# Altium schematic sheet i2c_to_gpio.SchDoc
size A4; SheetNumber: 6; SheetTotal: 6
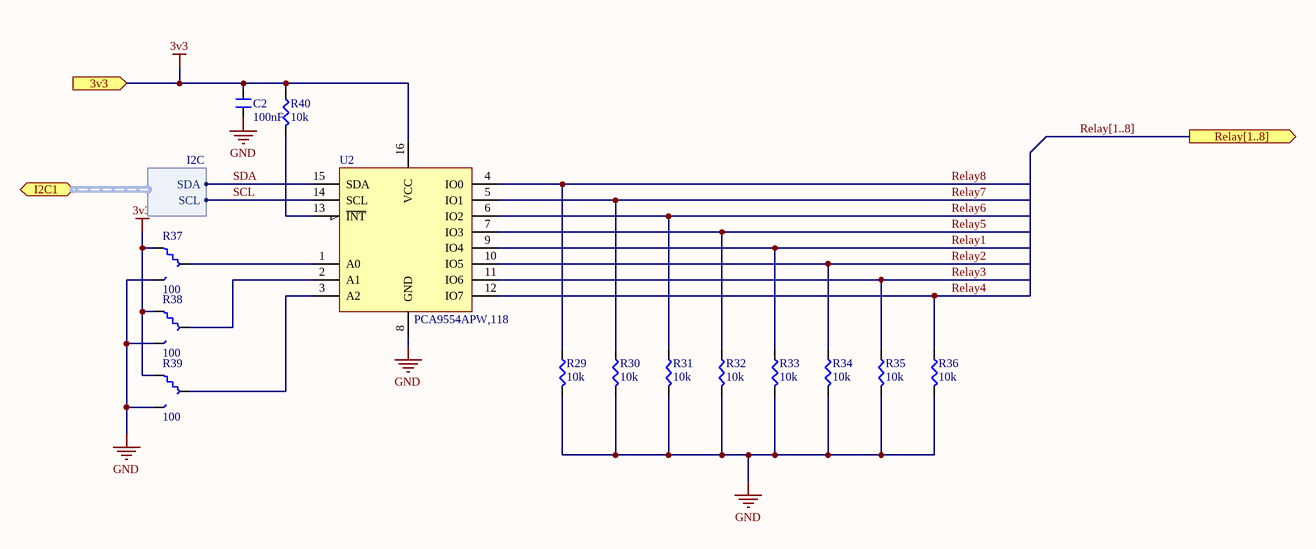
[diagram p0: i2c_to_gpio.SchDoc]

## Parts
C2  100nF  [CAP0603]
R29  10k  [RES0603]
R30  10k  [RES0603]
R31  10k  [RES0603]
R32  10k  [RES0603]
R33  10k  [RES0603]
R34  10k  [RES0603]
R35  10k  [RES0603]
R36  10k  [RES0603]
R37  100  [RES0603_CHANGE]
R38  100  [RES0603_CHANGE]
R39  100  [RES0603_CHANGE]
R40  10k  [RES0603]
U2  PCA9554APW,118  [TSSOP16]

## Ports
3v3 (in), I2C1 (bidir, harness I2C), Relay[1..8] (out)

## Harnesses
I2C: SDA, SCL

## Nets
3v3: C2.2 R37.1 R38.1 R39.1 R40.1 U2.16(VCC) ; port 3v3
GND: C2.1 R29.2 R30.2 R31.2 R32.2 R33.2 R34.2 R35.2 R36.2 R37.3 R38.3 R39.3 U2.8(GND)
Relay1: R33.1 U2.9(IO4)
Relay2: R34.1 U2.10(IO5)
Relay3: R35.1 U2.11(IO6)
Relay4: R36.1 U2.12(IO7)
Relay5: R32.1 U2.7(IO3)
Relay6: R31.1 U2.6(IO2)
Relay7: R30.1 U2.5(IO1)
Relay8: R29.1 U2.4(IO0)
SCL: U2.14(SCL) ; port I2C1.SCL
SDA: U2.15(SDA) ; port I2C1.SDA
NetR37_2: R37.2 U2.1(A0)
NetR38_2: R38.2 U2.2(A1)
NetR39_2: R39.2 U2.3(A2)
NetR40_2: R40.2 U2.13(~{INT})

## Buses and harness runs
bus Relay[1..8] = port Relay[1..8]

## Library data of the parts
C2 = GCM188R71H104KA57J: Tolerance ±10% / Rated Voltage 50Vdc / Temperature 0±30ppm/℃; Manufacturer: Arrow Electronics; Item: 100nF 50V  ±10%; Vdc: 50V; Part Number: GCM188R71H104KA57J; Supplier 1: Mouser; Supplier Part Number 1: 81-GCM188R71H104KA7J; Case: 0603; Tolerance: 10%; Value: 100nF; HelpURL: http://www.farnell.com/datasheets/4360.pdf?src-supplier=Element14; Category: Multilayer Ceramic Capacitors - SMD/SMT
R29-R36 R40 = CR0603-FX-1002ELF: Tolerance ±1% / Power (Watts) 0.1W, 1/10W / Temperature Coefficient ±100ppm/°C; Manufacturer: Bourns; Item: 10k  ±1% 0.1W; Part Number: CR0603-FX-1002ELF; Supplier 1: Mouser; Supplier Part Number 1: 652-CR0603FX-1002ELF; Case: 0603; Tolerance: 1%; Value: 10k; HelpURL: https://eu.mouser.com/datasheet/2/54/cr-1858361.pdf; Category: Thin Film Resistors - SMD
R37-R39 = ERJ-3EKF9101V (Jump_RES): Tolerance ±1% / Power (Watts) 0.1W, 1/10W / Temperature Coefficient ±100ppm/°C; Manufacturer: Panasonic; Item: 100 ±1% 0.1W (Jump_RES); Part Number: ERJ-3EKF9101V (Jump_RES); Supplier 1: Mouser; Supplier Part Number 1: 667-ERJ-3EKF9101V; Case: 0603; Tolerance: 1%; Value: 100; HelpURL: https://eu.mouser.com/datasheet/2/315/AOA0000C304-1149620.pdf; Category: Thin Film Resistors - SMD
U2 = PCA9554APW,118: Interface - I/O Expander I2C I/O; Manufacturer: NXP; Part Number: PCA9554APW,118; Item: PCA9554APW,118; Supplier 1: Mouser; Supplier Part Number 1: 771-PCA9554APW-T; Case: 16-TSSOP; HelpURL: https://eu.mouser.com/datasheet/2/302/PCA9554_9554A-1127609.pdf; Category: I/O Expanders